# EAGLE design MUS-1099 (EAGLE 8.2.1)
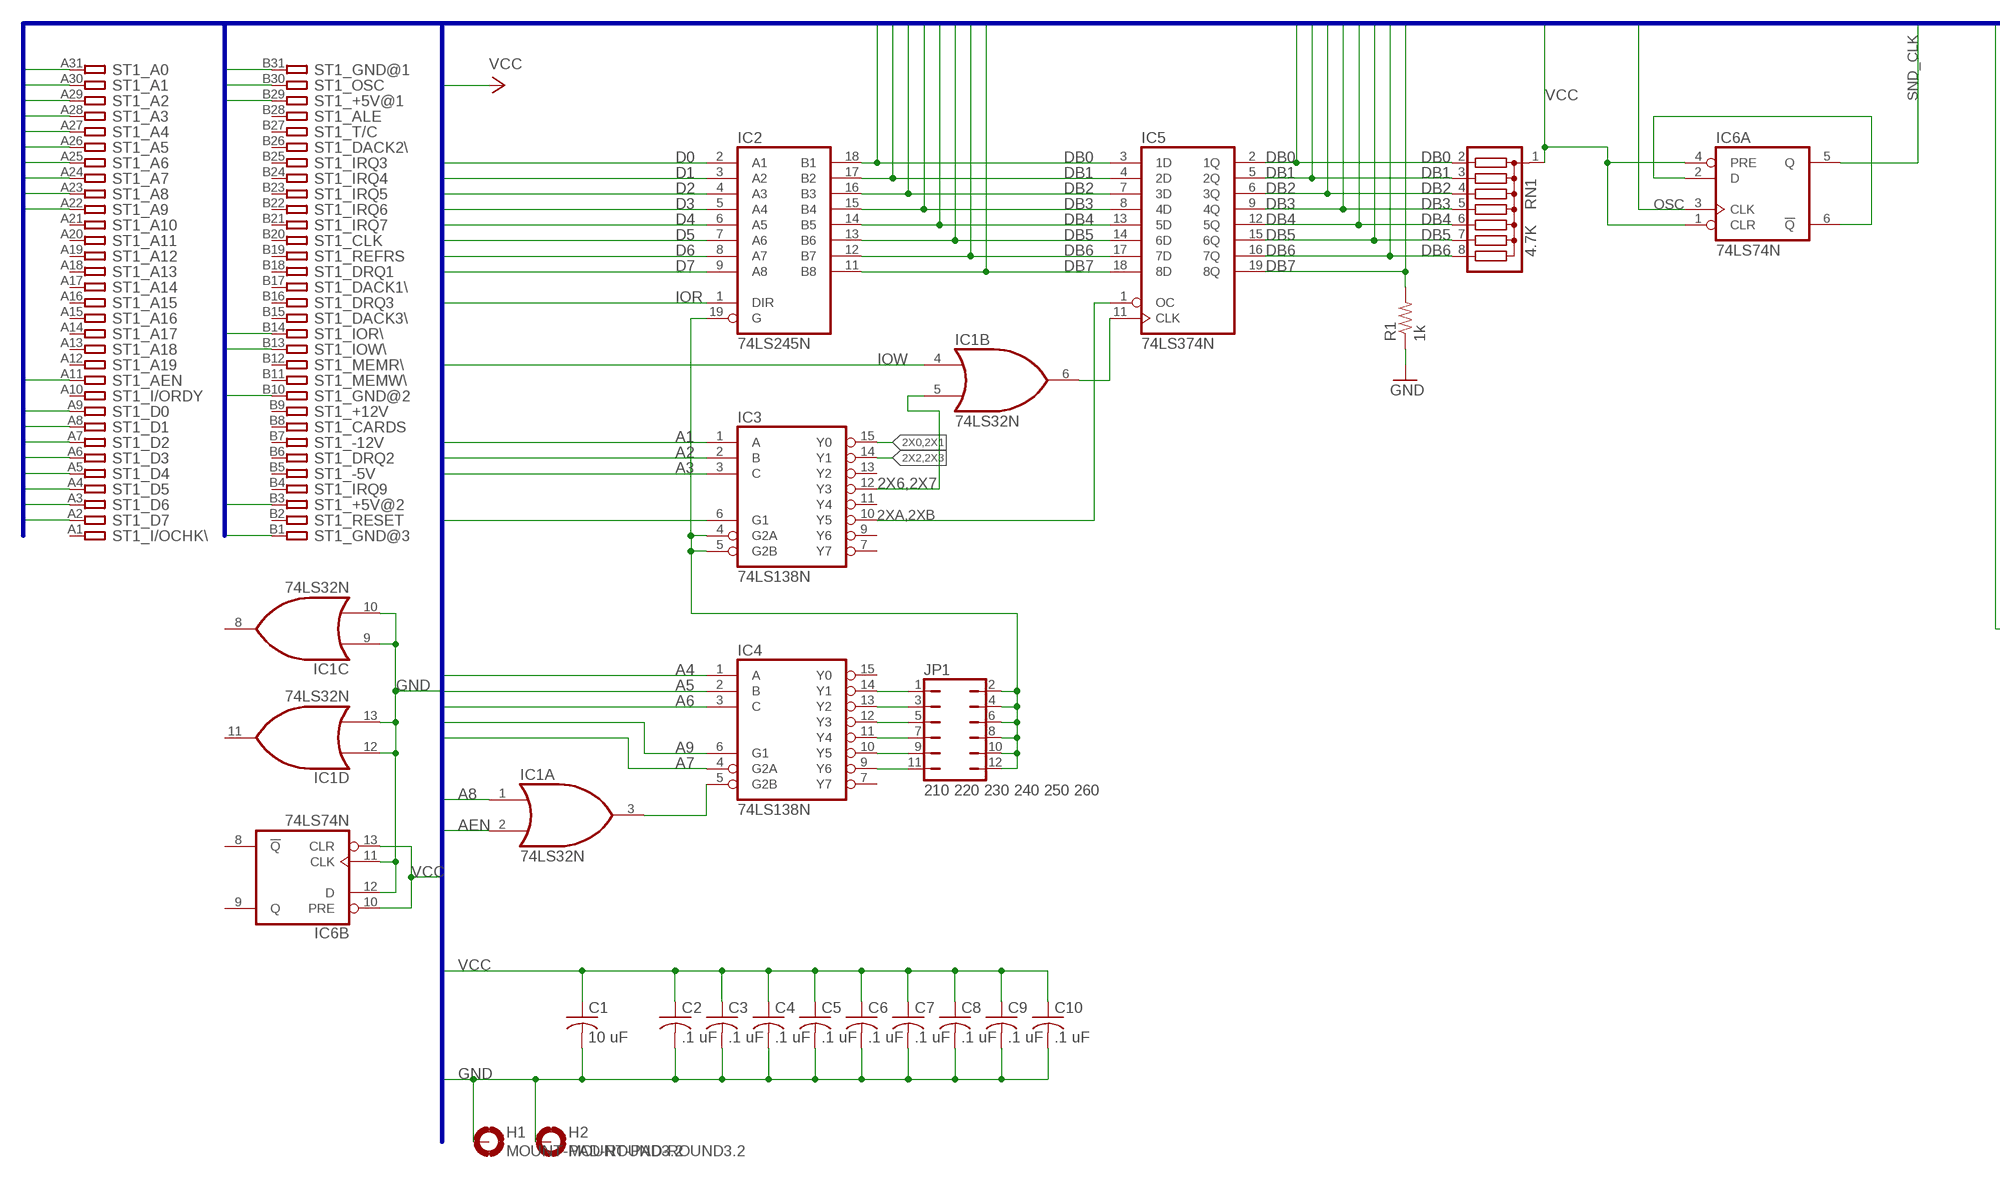
[diagram p0: schematic, sheet 1, part 1 of 2]
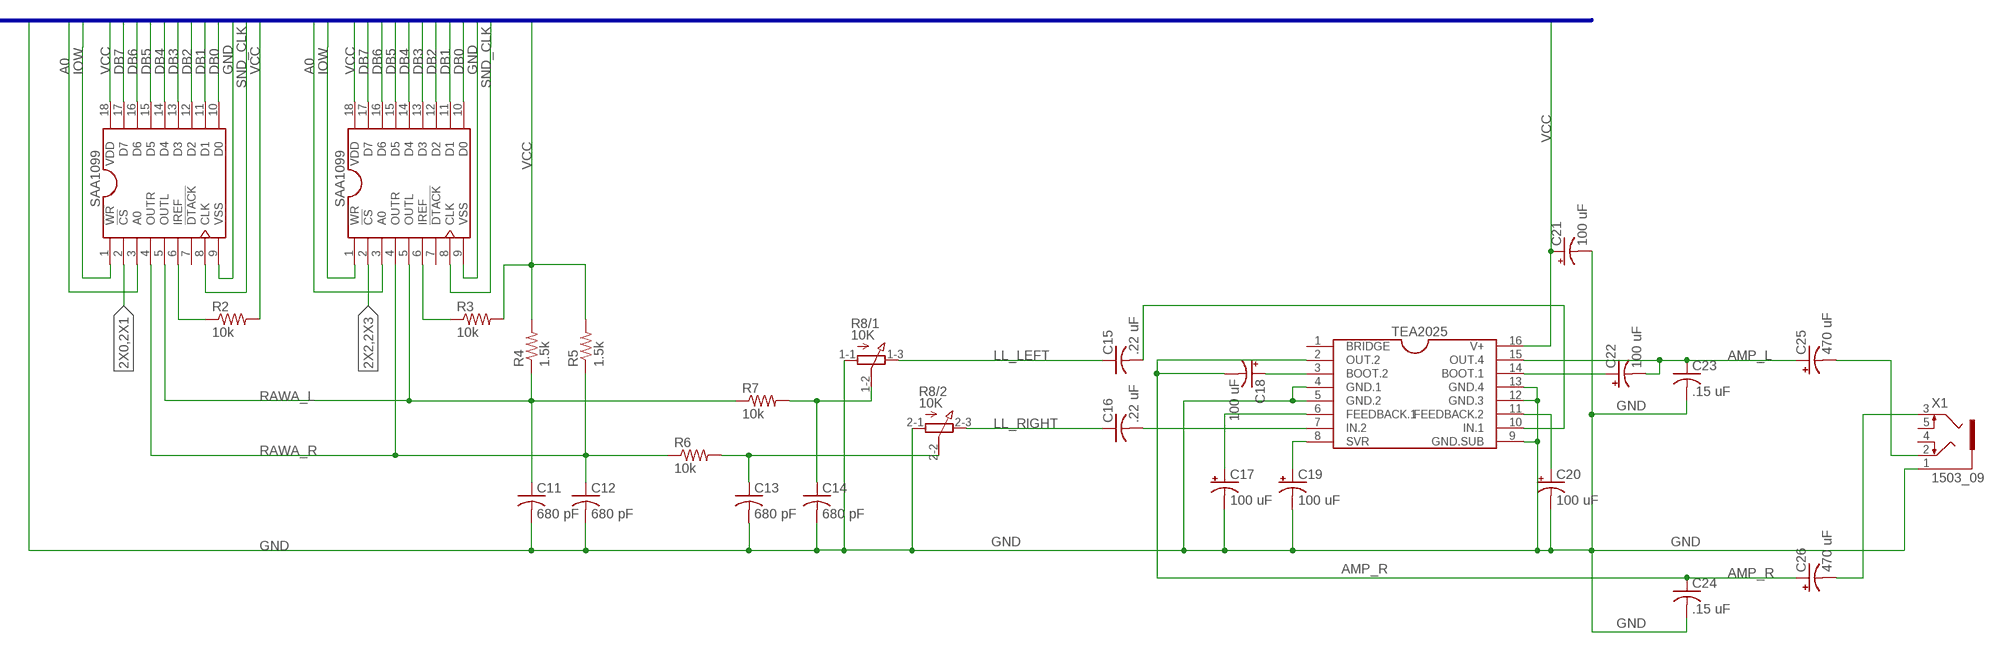
[diagram p1: schematic, sheet 1, part 2 of 2]

## Parts
C1  10 uF  C-US025-025X050  [C025-025X050]
C2  .1 uF  C-US025-025X050  [C025-025X050]
C3  .1 uF  C-US025-025X050  [C025-025X050]
C4  .1 uF  C-US025-025X050  [C025-025X050]
C5  .1 uF  C-US025-025X050  [C025-025X050]
C6  .1 uF  C-US025-025X050  [C025-025X050]
C7  .1 uF  C-US025-025X050  [C025-025X050]
C8  .1 uF  C-US025-025X050  [C025-025X050]
C9  .1 uF  C-US025-025X050  [C025-025X050]
C10  .1 uF  C-US025-025X050  [C025-025X050]
C11  680 pF  C-US025-025X050  [C025-025X050]
C12  680 pF  C-US025-025X050  [C025-025X050]
C13  680 pF  C-US025-025X050  [C025-025X050]
C14  680 pF  C-US025-025X050  [C025-025X050]
C15  .22 uF  C-US025-025X050  [C025-025X050]
C16  .22 uF  C-US025-025X050  [C025-025X050]
C17  100 uF  CPOL-USE5-10.5  [E5-10,5]
C18  100 uF  CPOL-USE5-10.5  [E5-10,5]
C19  100 uF  CPOL-USE5-10.5  [E5-10,5]
C20  100 uF  CPOL-USE5-10.5  [E5-10,5]
C21  100 uF  CPOL-USE5-10.5  [E5-10,5]
C22  100 uF  CPOL-USE5-10.5  [E5-10,5]
C23  .15 uF  C-US025-025X050  [C025-025X050]
C24  .15 uF  C-US025-025X050  [C025-025X050]
C25  470 uF  CPOL-USE5-10.5  [E5-10,5]
C26  470 uF  CPOL-USE5-10.5  [E5-10,5]
H1  MOUNT-PAD-ROUND3.2  [3,2-PAD]
H2  MOUNT-PAD-ROUND3.2  [3,2-PAD]
IC1  74LS32N  [DIL14]
IC2  74LS245N  [DIL20]
IC3  74LS138N  [DIL16]
IC4  74LS138N  [DIL16]
IC5  74LS374N  [DIL20]
IC6  74LS74N  [DIL14]
IC7  SAA1099  [DIL18]
IC8  SAA1099  [DIL18]
IC9  TEA2025  [DIL16]
JP1  210 220 230 240 250 260  JP6Q  [JP6Q]
R1  1k  R-US_0207/10  [0207/10]
R2  10k  R-US_0207/10  [0207/10]
R3  10k  R-US_0207/10  [0207/10]
R4  1.5k  R-US_0207/10  [0207/10]
R5  1.5k  R-US_0207/10  [0207/10]
R6  10k  R-US_0207/10  [0207/10]
R7  10k  R-US_0207/10  [0207/10]
R8  10K  3RP/1610G  [3RP/1610G]
RN1  4.7K  G07R  [SIL8]
ST1  8 bit ISA  IBM8BIT  [IBM8BIT]
X1  1503_09  [1503_09]

## Nets
2X0,2X1: IC3.15(Y0) IC7.2(!CS!)
2X2,2X3: IC3.14(Y1) IC8.2(!CS!)
2X6,2X7: IC1.5(B:I1) IC3.12(Y3)
2XA,2XB: IC3.10(Y5) IC5.1(OC)
A0: IC7.3(A0) IC8.3(A0) ST1.A31
A1: IC3.1(A) ST1.A30
A2: IC3.2(B) ST1.A29
A3: IC3.3(C) ST1.A28
A4: IC4.1(A) ST1.A27
A5: IC4.2(B) ST1.A26
A6: IC4.3(C) ST1.A25
A7: IC4.4(G2A) ST1.A24
A8: IC1.1(A:I0) ST1.A23
A9: IC4.6(G1) ST1.A22
AEN: IC1.2(A:I1) ST1.A11
AMP_L: C22.- C23.1 C25.+ IC9.15(OUT.4)
AMP_R: C18.- C24.1 C26.+ IC9.2(OUT.2)
D0: IC2.2(A1) ST1.A9
D1: IC2.3(A2) ST1.A8
D2: IC2.4(A3) ST1.A7
D3: IC2.5(A4) ST1.A6
D4: IC2.6(A5) ST1.A5
D5: IC2.7(A6) ST1.A4
D6: IC2.8(A7) ST1.A3
D7: IC2.9(A8) ST1.A2
DB0: IC2.18(B1) IC5.2(1Q) IC5.3(1D) IC7.10(D0) IC8.10(D0) RN1.2
DB1: IC2.17(B2) IC5.4(2D) IC5.5(2Q) IC7.11(D1) IC8.11(D1) RN1.3
DB2: IC2.16(B3) IC5.6(3Q) IC5.7(3D) IC7.12(D2) IC8.12(D2) RN1.4
DB3: IC2.15(B4) IC5.8(4D) IC5.9(4Q) IC7.13(D3) IC8.13(D3) RN1.5
DB4: IC2.14(B5) IC5.12(5Q) IC5.13(5D) IC7.14(D4) IC8.14(D4) RN1.6
DB5: IC2.13(B6) IC5.14(6D) IC5.15(6Q) IC7.15(D5) IC8.15(D5) RN1.7
DB6: IC2.12(B7) IC5.16(7Q) IC5.17(7D) IC7.16(D6) IC8.16(D6) RN1.8
DB7: IC2.11(B8) IC5.18(8D) IC5.19(8Q) IC7.17(D7) IC8.17(D7) R1.2
GND: C1.2 C2.2 C3.2 C4.2 C5.2 C6.2 C7.2 C8.2 C9.2 C10.2 C11.2 C12.2 C13.2 C14.2 C17.- C19.- C20.- C21.- C23.2 C24.2 H1.B3,2(MOUNT) H2.B3,2(MOUNT) IC1.9(C:I0) IC1.10(C:I1) IC1.12(D:I0) IC1.13(D:I1) IC6.11(B:CLK) IC6.12(B:D) IC7.9(VSS) IC8.9(VSS) IC9.4(GND.1) IC9.5(GND.2) IC9.9(GND.SUB) IC9.12(GND.3) IC9.13(GND.4) R1.1 R8.1-1(/1:A) R8.2-1(/2:A) ST1.B1 ST1.B10 ST1.B31 X1.1
IOR: IC2.1(DIR) ST1.B14
IOW: IC1.4(B:I0) IC7.1(!WR!) IC8.1(!WR!) ST1.B13
LL_LEFT: C15.1 R8.1-3(/1:E)
LL_RIGHT: C16.1 R8.2-3(/2:E)
N210: IC4.14(Y1) JP1.1
N220: IC4.13(Y2) JP1.3
N230: IC4.12(Y3) JP1.5
N240: IC4.11(Y4) JP1.7
N250: IC4.10(Y5) JP1.9
N260: IC4.9(Y6) JP1.11
N$1: IC1.3(A:O) IC4.5(G2B)
N$8: IC2.19(G) IC3.4(G2A) IC3.5(G2B) JP1.2 JP1.4 JP1.6 JP1.8 JP1.10 JP1.12
N$10: IC1.6(B:O) IC5.11(CLK)
N$11: IC6.2(A:D) IC6.6(A:!Q)
N$12: C13.1 R6.2 R8.2-2(/2:S)
N$13: C14.1 R7.2 R8.1-2(/1:S)
N$14: IC7.6(IREF) R2.1
N$15: IC8.6(IREF) R3.1
N$16: C16.2 IC9.7(IN.2)
N$17: C15.2 IC9.10(IN.1)
N$18: C17.+ IC9.6(FEEDBACK.1)
N$19: C20.+ IC9.11(FEEDBACK.2)
N$20: C25.- X1.2
N$21: C26.- X1.3
N$22: C19.+ IC9.8(SVR)
N$23: C22.+ IC9.14(BOOT.1)
N$25: C18.+ IC9.3(BOOT.2)
OSC: IC6.3(A:CLK) ST1.B30
RAWA_L: C11.1 IC7.5(OUTL) IC8.5(OUTL) R4.1 R7.1
RAWA_R: C12.1 IC7.4(OUTR) IC8.4(OUTR) R5.1 R6.1
SND_CLK: IC6.5(A:Q) IC7.8(CLK) IC8.8(CLK)
VCC: C1.1 C2.1 C3.1 C4.1 C5.1 C6.1 C7.1 C8.1 C9.1 C10.1 C21.+ IC3.6(G1) IC6.1(A:CLR) IC6.4(A:PRE) IC6.10(B:PRE) IC6.13(B:CLR) IC7.18(VDD) IC8.18(VDD) IC9.16(V+) R2.2 R3.2 R4.2 R5.2 RN1.1 ST1.B3 ST1.B29
Unconnected: IC1.8(C:O) IC1.11(D:O) IC3.7(Y7) IC3.9(Y6) IC3.11(Y4) IC3.13(Y2) IC4.7(Y7) IC4.15(Y0) IC6.8(B:!Q) IC6.9(B:Q) IC7.7(!DTACK!) IC8.7(!DTACK!) IC9.1(BRIDGE) ST1.A1 ST1.A10 ST1.A12 ST1.A13 ST1.A14 ST1.A15 ST1.A16 ST1.A17 ST1.A18 ST1.A19 ST1.A20 ST1.A21 ST1.B2 ST1.B4 ST1.B5 ST1.B6 ST1.B7 ST1.B8 ST1.B9 ST1.B11 ST1.B12 ST1.B15 ST1.B16 ST1.B17 ST1.B18 ST1.B19 ST1.B20 ST1.B21 ST1.B22 ST1.B23 ST1.B24 ST1.B25 ST1.B26 ST1.B27 ST1.B28 X1.4 X1.5

## Buses
A[0..9],AEN,IOR,D[0..7],DB[0..7],IOW,OSC,SND_CLK,VCC,GND

## Power pins joined to a net without a drawn wire
GND: IC1.7(P:GND) IC2.10(GND) IC3.8(GND) IC4.8(GND) IC5.10(GND) IC6.7(P:GND)
VCC: IC1.14(P:VCC) IC2.20(VCC) IC3.16(VCC) IC4.16(VCC) IC5.20(VCC) IC6.14(P:VCC)

## Library data of the parts
C1-C16 C23 C24 = resistor:C-US: CAPACITOR, American symbol
C17-C22 C25 C26 = rcl:CPOL-US: POLARIZED CAPACITOR, American symbol
H1 H2 = holes:MOUNT-PAD-ROUND: MOUNTING PAD, round
IC1 = 74xx-us:74*32: Quad 2-input OR gate
IC2 = 74xx-us:74*245: Octal BUS TRANSCEIVER, 3-state
IC3 IC4 = 74xx-us:74*138: 3-line to 8-line DECODER/DEMULTIPLEXER
IC5 = 74xx-us:74*374: Octal D type transparent LATCH, edge triggered
IC6 = 74xx-us:74*74: Dual D type positive edge triggered FLIP FLOP, preset and clear
IC7 IC8 = William-Custom:SAA1099
IC9 = William-Custom:TEA2025
JP1 = William-Custom:JP6Q: JUMPER
R1-R7 = resistor:R-US_: RESISTOR, American symbol
R8 = pot:3RP/1610G: 16mm Potentiometer two level Source: http://www.alphapotentiometers.net/html/16mm_pot_2.html
RN1 = resistor-sil:G07R: SIL RESISTOR; OC_FARNELL: unknown; OC_NEWARK: unknown
ST1 = William-Custom:IBM8BIT: 8-bit CARD IBM/PC-AT
X1 = con-lumberg:1503_09: Jack connectors according to JISC 6560, 3.5 mm Klinkeneinbaukupplung nach JISC 6560, 3,5 mm, 3-polig/ stereo, abgewinkelte Ausführung, mit 2 Öffnern und Lötaugen, für Leiterplatten Rückseitenmontage Source: http://www.lumberg.com/Produkte/PDFs/1503_09.pdf; OC_FARNELL: 1243244; OC_NEWARK: unknown

## Board
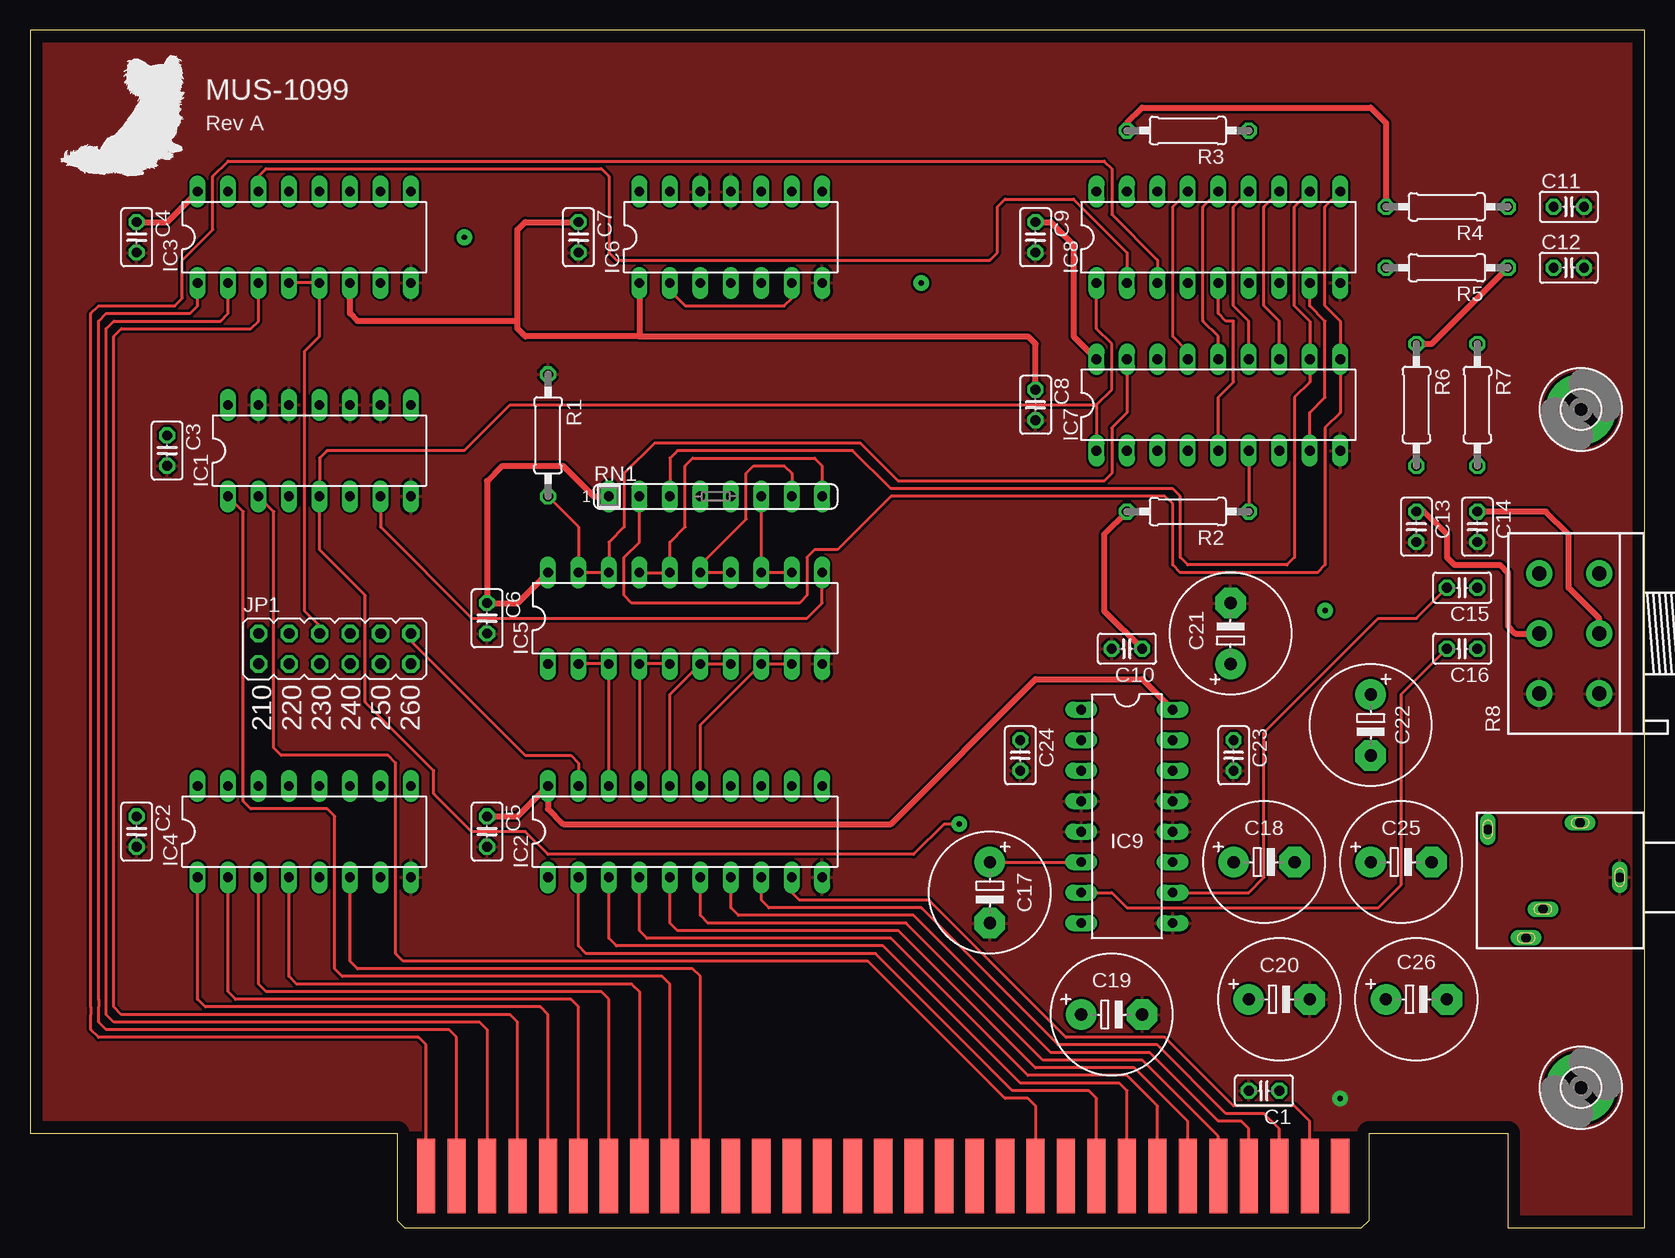
[diagram p2: board, top side]
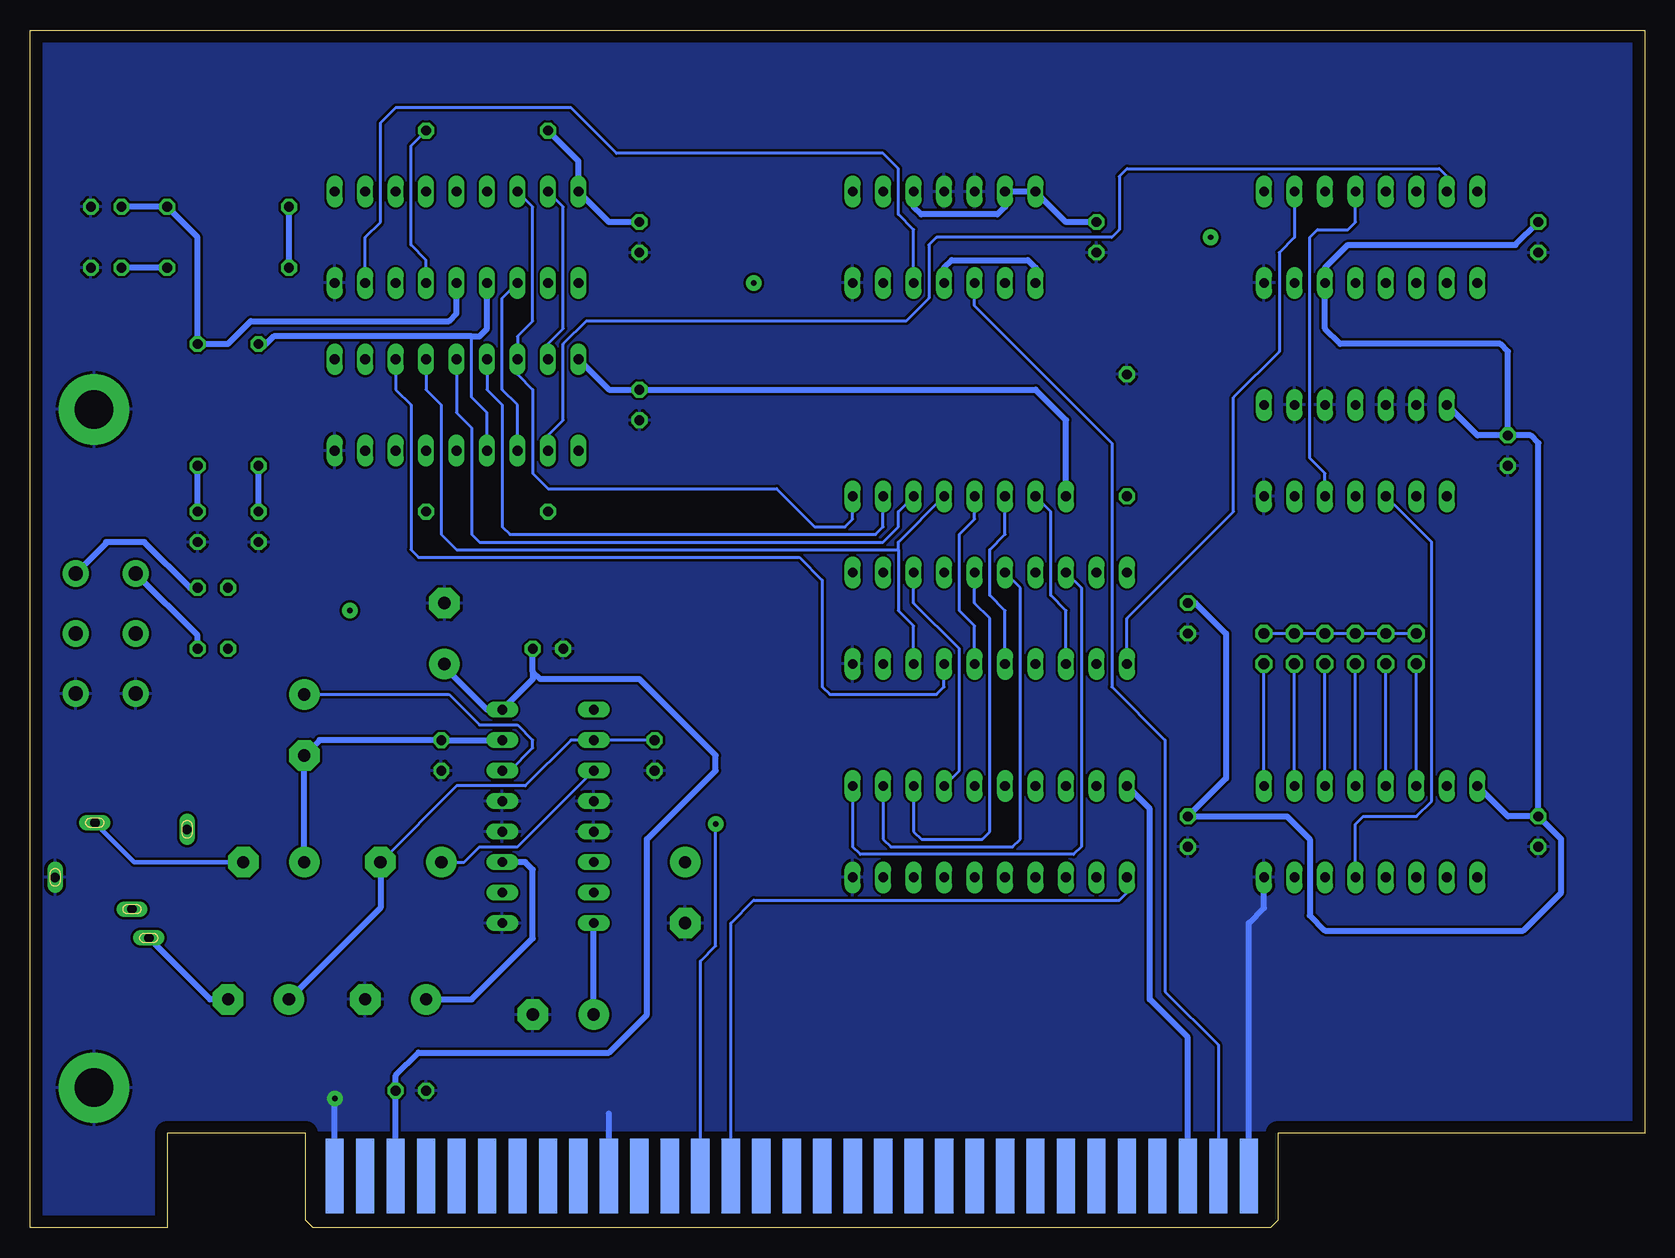
[diagram p3: board, bottom side, seen from below]

Size 134.62 x 99.82 mm. Coordinates in mm from the lower left corner, seen from the top.
Outline: 0,7.87 30.61,7.87 30.61,0.64 31.24,0 111,0 111.63,0.64 111.63,7.87 123.19,7.87 123.19,0 134.62,0 134.62,99.82 0,99.82 0,7.87
Copper layers (1*16): Top 0.035mm / dielectric 1.5mm / Bottom 0.035mm
Design rules "default *": minimum track width 8mil, minimum drill 16mil, track to track 8mil, track to pad 8mil, pad to pad 8mil, via to via 8mil, smd to smd 8mil, copper to edge 40mil, drill to drill 8mil, minimum pad ring 10mil, minimum via ring 8mil, stop-mask expansion 4mil, vias tented up to drill 0mil, thermal gap 10mil

### Footprints (pad centres in the part's own frame; a part is rotated, then mirrored left to right if it is on the bottom)
C025-025X050 = drill 0.813 octagon: 1 -1.27,0; 2 1.27,0
E5-10,5 = drill 1.016 pad 2.54: + -2.54,0 | drill 1.016 pad 2.54 octagon: - 2.54,0
3,2-PAD = drill 3.2 pad 5.842: B3,2 0,0
DIL14 = drill 0.813 long: 1 -7.62,-3.81; 2 -5.08,-3.81; 3 -2.54,-3.81; 4 0,-3.81; 5 2.54,-3.81; 6 5.08,-3.81; 7 7.62,-3.81; 8 7.62,3.81; 9 5.08,3.81; 10 2.54,3.81; 11 0,3.81; 12 -2.54,3.81; 13 -5.08,3.81; 14 -7.62,3.81
DIL20 = drill 0.813 long: 1 -11.43,-3.81; 2 -8.89,-3.81; 3 -6.35,-3.81; 4 -3.81,-3.81; 5 -1.27,-3.81; 6 1.27,-3.81; 7 3.81,-3.81; 8 6.35,-3.81; 9 8.89,-3.81; 10 11.43,-3.81; 11 11.43,3.81; 12 8.89,3.81; 13 6.35,3.81; 14 3.81,3.81; 15 1.27,3.81; 16 -1.27,3.81; 17 -3.81,3.81; 18 -6.35,3.81; 19 -8.89,3.81; 20 -11.43,3.81
DIL16 = drill 0.813 long: 1 -8.89,-3.81; 2 -6.35,-3.81; 3 -3.81,-3.81; 4 -1.27,-3.81; 5 1.27,-3.81; 6 3.81,-3.81; 7 6.35,-3.81; 8 8.89,-3.81; 9 8.89,3.81; 10 6.35,3.81; 11 3.81,3.81; 12 1.27,3.81; 13 -1.27,3.81; 14 -3.81,3.81; 15 -6.35,3.81; 16 -8.89,3.81
DIL18 = drill 0.813 long: 1 -10.16,-3.81; 2 -7.62,-3.81; 3 -5.08,-3.81; 4 -2.54,-3.81; 5 0,-3.81; 6 2.54,-3.81; 7 5.08,-3.81; 8 7.62,-3.81; 9 10.16,-3.81; 10 10.16,3.81; 11 7.62,3.81; 12 5.08,3.81; 13 2.54,3.81; 14 0,3.81; 15 -2.54,3.81; 16 -5.08,3.81; 17 -7.62,3.81; 18 -10.16,3.81
JP6Q = drill 0.914 octagon: 1 -6.35,-1.27; 2 -6.35,1.27; 3 -3.81,-1.27; 4 -3.81,1.27; 5 -1.27,-1.27; 6 -1.27,1.27; 7 1.27,-1.27; 8 1.27,1.27; 9 3.81,-1.27; 10 3.81,1.27; 11 6.35,-1.27; 12 6.35,1.27
0207/10 = drill 0.813 octagon: 1 -5.08,0; 2 5.08,0
3RP/1610G = drill 1.2 pad 2.184: 1-1 -5,0; 1-2 0,0; 1-3 5,0; 2-1 -5,5; 2-2 0,5; 2-3 5,5
SIL8 = drill 0.813 long: 1 -8.89,0; 2 -6.35,0; 3 -3.81,0; 4 -1.27,0; 5 1.27,0; 6 3.81,0; 7 6.35,0; 8 8.89,0
IBM8BIT = smd 1.524 x 6.223: A1 -25.4,4.826; A2 -27.94,4.826; A3 -30.48,4.826; A4 -33.02,4.826; A5 -35.56,4.826; A6 -38.1,4.826; A7 -40.64,4.826; A8 -43.18,4.826; A9 -45.72,4.826; A10 -48.26,4.826; A11 -50.8,4.826; A12 -53.34,4.826; A13 -55.88,4.826; A14 -58.42,4.826; A15 -60.96,4.826; A16 -63.5,4.826; A17 -66.04,4.826; A18 -68.58,4.826; A19 -71.12,4.826; A20 -73.66,4.826; A21 -76.2,4.826; A22 -78.74,4.826; A23 -81.28,4.826; A24 -83.82,4.826; A25 -86.36,4.826; A26 -88.9,4.826; A27 -91.44,4.826; A28 -93.98,4.826; A29 -96.52,4.826; A30 -99.06,4.826; A31 -101.6,4.826 | smd 1.524 x 6.223 bottom: B1 -25.4,4.826; B2 -27.94,4.826; B3 -30.48,4.826; B4 -33.02,4.826; B5 -35.56,4.826; B6 -38.1,4.826; B7 -40.64,4.826; B8 -43.18,4.826; B9 -45.72,4.826; B10 -48.26,4.826; B11 -50.8,4.826; B12 -53.34,4.826; B13 -55.88,4.826; B14 -58.42,4.826; B15 -60.96,4.826; B16 -63.5,4.826; B17 -66.04,4.826; B18 -68.58,4.826; B19 -71.12,4.826; B20 -73.66,4.826; B21 -76.2,4.826; B22 -78.74,4.826; B23 -81.28,4.826; B24 -83.82,4.826; B25 -86.36,4.826; B26 -88.9,4.826; B27 -91.44,4.826; B28 -93.98,4.826; B29 -96.52,4.826; B30 -99.06,4.826; B31 -101.6,4.826
1503_09 = drill 0.8 pad 1.2 long: 1 0,-2.1; 2 -4.55,-5.4; 3 5.05,-9.9; 4 -4,-13.1; 5 2.65,-8.5

### Placement (x,y rotation side)
C1  102.87,11.43 180 top
C2  8.89,33.02 270 top
C3  11.43,64.77 270 top
C4  8.89,82.55 270 top
C5  38.1,33.02 270 top
C6  38.1,50.8 270 top
C7  45.72,82.55 270 top
C8  83.82,68.58 270 top
C9  83.82,82.55 270 top
C10  91.44,48.26 180 top
C11  128.27,85.09 0 top
C12  128.27,80.01 0 top
C13  115.57,58.42 270 top
C14  120.65,58.42 270 top
C15  119.38,53.34 180 top
C16  119.38,48.26 180 top
C17  80.01,27.94 270 top
C18  102.87,30.48 0 top
C19  90.17,17.78 0 top
C20  104.14,19.05 0 top
C21  100.08,49.53 90 top
C22  111.76,41.91 270 top
C23  100.33,39.37 270 top
C24  82.55,39.37 270 top
C25  114.3,30.48 0 top
C26  115.57,19.05 0 top
H1  129.29,68.2 0 top
H2  129.29,11.68 0 top
IC1  24.13,64.77 0 top
IC2  54.61,33.02 0 top
IC3  22.86,82.55 0 top
IC4  22.86,33.02 0 top
IC5  54.61,50.8 0 top
IC6  58.42,82.55 0 top
IC7  99.06,68.58 0 top
IC8  99.06,82.55 0 top
IC9  91.44,34.29 270 top
JP1  25.4,48.26 0 top
R1  43.18,66.04 270 top
R2  96.52,59.69 180 top
R3  96.52,91.44 180 top
R4  118.11,85.09 180 top
R5  118.11,80.01 180 top
R6  115.57,68.58 270 top
R7  120.65,68.58 270 top
R8  130.81,49.53 90 top
RN1  57.15,60.96 0 top
ST1  134.62,-0.51 0 top
U$1  [LOGO]  2.54,87.63 0 top
X1  134.62,29.21 270 top

### Tracks (layer width: path | path; a pad name or v marks a point on that pad's centre or on a via)
2X0,2X1
  Bottom 0.254: IC7.2 91.44,66.04 90.17,67.31 90.17,73.66 88.27,75.56 61.59,75.56 59.69,77.47 59.69,81.92 59.05,82.55 44.45,82.55 43.81,83.19 43.81,87.63 43.18,88.27 17.14,88.27 16.51,87.63 IC3.15
2X2,2X3
  Top 0.254: IC3.14 19.05,87.63 19.68,88.27 47.62,88.27 48.26,87.63 48.26,81.28 48.9,80.64 80.01,80.64 80.64,81.28 80.64,85.09 81.28,85.72 87,85.72 91.44,81.28 91.44,80.01 91.44,79.38 IC8.2
2X6,2X7
  Bottom 0.254: IC1.5 26.67,62.87 27.94,64.14 27.94,82.55 27.3,83.19 24.77,83.19 24.13,83.82 IC3.12
2XA,2XB
  Bottom 0.254: IC3.10 29.21,82.55 30.48,81.28 30.48,73.03 34.29,69.22 34.29,59.69 43.18,50.8 IC5.1
A0
  Top 0.254: IC8.3 93.98,80.64 90.17,84.45 90.17,88.27 89.53,88.9 16.51,88.9 15.24,87.63 15.24,83.19 12.7,80.64 12.7,77.47 12.06,76.83 5.71,76.83 5.08,76.2 5.08,18.41 5.08,17.78 5.08,16.51 5.71,15.88 32.38,15.88 33.02,15.24 ST1.A31
  Bottom 0.254: IC8.3 95.25,77.47 95.25,69.85 93.98,68.58 IC7.3
A1
  Top 0.254: IC3.1 13.97,76.83 13.34,76.2 6.35,76.2 5.71,75.56 5.71,19.05 5.71,18.41 5.71,17.14 6.35,16.51 34.92,16.51 35.56,15.88 ST1.A30
A2
  Top 0.254: IC3.2 16.51,76.2 15.88,75.56 6.99,75.56 6.35,74.93 6.35,17.78 6.99,17.14 37.47,17.14 38.1,16.51 ST1.A29 38.1,3.81
A3
  Top 0.254: IC3.3 19.05,75.56 18.41,74.93 7.62,74.93 6.99,74.3 6.99,18.41 7.62,17.78 40.01,17.78 40.64,17.14 ST1.A28
A4
  Top 0.254: ST1.A27 43.18,17.78 42.55,18.41 14.61,18.41 13.97,19.05 IC4.1
A5
  Top 0.254: ST1.A26 45.72,18.41 45.09,19.05 17.14,19.05 16.51,19.68 IC4.2
A6
  Top 0.254: ST1.A25 48.26,19.05 47.62,19.68 19.68,19.68 19.05,20.32 IC4.3
A7
  Top 0.254: ST1.A24 50.8,19.68 50.16,20.32 22.23,20.32 21.59,20.95 IC4.4
A8
  Top 0.254: ST1.A23 53.34,20.32 52.7,20.95 26.04,20.95 25.4,21.59 25.4,34.29 24.77,34.92 18.41,34.92 17.78,35.56 17.78,59.69 IC1.1
A9
  Top 0.254: ST1.A22 55.88,20.95 55.24,21.59 27.3,21.59 26.67,22.23 IC4.6
AEN
  Top 0.254: IC1.2 20.32,59.69 20.32,40.01 20.95,39.37 29.84,39.37 30.48,38.73 30.48,22.86 31.11,22.23 69.85,22.23 81.28,10.79 83.19,10.79 83.82,10.16 ST1.A11
AMP_L
  Bottom 0.508: C25.+ C22.- 110.49,40.64 C23.1 IC9.15
AMP_R
  Bottom 0.254: C18.- 99.06,36.83 93.34,36.83 89.53,40.64 IC9.2 C24.1
  Bottom 0.508: C18.- 105.41,26.67 C26.+
D0
  Top 0.254: ST1.A9 88.9,10.79 88.27,11.43 81.92,11.43 70.48,22.86 46.35,22.86 45.72,23.5 IC2.2
D1
  Top 0.254: ST1.A8 91.44,11.43 90.81,12.06 82.55,12.06 71.12,23.5 48.9,23.5 48.26,24.13 IC2.3
D2
  Top 0.254: ST1.A7 93.98,10.16 91.44,12.7 83.19,12.7 71.75,24.13 51.44,24.13 50.8,24.77 IC2.4
D3
  Top 0.254: ST1.A6 96.52,8.89 92.08,13.34 83.82,13.34 72.39,24.77 53.98,24.77 53.34,25.4 IC2.5
D4
  Top 0.254: IC2.6 55.88,26.04 56.52,25.4 73.03,25.4 84.45,13.97 92.71,13.97 99.06,7.62 ST1.A5
D5
  Top 0.254: IC2.7 58.42,26.67 59.05,26.04 73.66,26.04 85.09,14.61 93.34,14.61 99.06,8.89 100.97,8.89 101.6,8.26 ST1.A4
D6
  Top 0.254: IC2.8 60.96,27.3 61.59,26.67 74.3,26.67 85.72,15.24 93.98,15.24 99.69,9.53 102.87,9.53 104.14,8.26 ST1.A3
D7
  Top 0.254: ST1.A2 106.68,8.89 105.41,10.16 100.33,10.16 94.61,15.88 86.36,15.88 74.93,27.3 64.14,27.3 63.5,27.94 IC2.9
DB0
  Top 0.254: IC8.10 107.95,85.09 107.95,76.83 109.22,75.56 IC7.10 109.22,67.94 107.95,66.67 107.95,55.24 107.31,54.61 95.89,54.61 95.25,55.24 95.25,60.33 94.61,60.96 71.75,60.96 67.31,56.52 65.41,56.52 64.77,55.88 64.77,52.7 64.14,52.07 50.16,52.07 49.53,52.7 49.53,55.88 50.8,57.15 RN1.2 | IC2.18 IC5.3 IC5.2
  Bottom 0.254: IC5.3 48.26,51.44 49.53,52.7 49.53,59.69 RN1.2
DB1
  Top 0.254: IC8.11 105.41,85.09 105.41,76.83 106.68,75.56 IC7.11 106.68,70.48 105.41,69.22 105.41,55.88 104.78,55.24 96.52,55.24 95.89,55.88 95.89,60.96 95.25,61.59 71.75,61.59 68.58,64.77 53.98,64.77 53.34,64.14 RN1.3 | IC5.5 IC5.4 IC2.17
  Bottom 0.254: IC5.5 53.34,51.44 54.61,52.7 54.61,56.52 53.34,57.78 RN1.3
DB2
  Top 0.254: IC7.12 104.14,75.56 102.87,76.83 102.87,85.09 IC8.12 | IC2.16 53.34,44.45 IC5.6 IC5.7
  Bottom 0.254: IC5.6 55.88,50.16 57.15,51.44 57.15,57.78 55.88,59.05 RN1.4 | IC7.12 104.14,69.85 102.87,68.58 102.87,56.52 102.23,55.88 70.48,55.88 68.58,53.98 68.58,45.09 67.94,44.45 59.05,44.45 58.42,45.09 IC5.7
DB3
  Top 0.254: IC7.13 101.6,75.56 100.33,76.83 100.33,85.09 IC8.13 | IC5.9 IC5.8 55.88,41.91 IC2.15
  Bottom 0.254: IC5.8 60.96,50.16 62.23,51.44 62.23,56.52 | 62.23,56.52 62.23,57.15 RN1.5 | IC7.13 101.6,69.85 100.33,68.58 100.33,57.78 99.06,56.52 62.23,56.52
DB4
  Top 0.254: IC7.14 99.06,74.3 97.79,75.56 97.79,85.09 IC8.14 | IC5.12 IC5.13 RN1.6
  Bottom 0.254: IC2.14 57.15,38.1 57.15,48.26 60.96,52.07 IC5.13 | IC7.14 99.06,67.94 97.79,66.67 97.79,57.78 97.16,57.15 63.5,57.15 62.23,58.42 62.23,59.69 RN1.6
DB5
  Top 0.254: IC7.15 96.52,73.03 95.25,74.3 95.25,85.09 IC8.15 | IC5.14 IC5.15 55.88,55.24 59.69,59.05 59.69,62.87 60.33,63.5 62.87,63.5 63.5,62.87 RN1.7
  Bottom 0.254: IC2.13 60.96,33.02 60.33,32.38 55.24,32.38 54.61,33.02 54.61,50.8 55.88,52.07 IC5.15 | IC7.15 96.52,69.85 95.25,68.58 95.25,58.42 94.61,57.78 64.14,57.78 63.5,58.42 RN1.7
DB6
  Top 0.254: IC5.17 IC5.16 53.34,57.15 54.61,58.42 54.61,63.5 55.24,64.14 65.41,64.14 66.04,63.5 RN1.8
  Bottom 0.254: IC8.16 92.71,85.09 92.71,75.56 93.98,74.3 IC7.16 93.98,71.12 92.71,69.85 92.71,62.87 91.44,61.59 72.39,61.59 69.22,58.42 66.67,58.42 66.04,59.05 RN1.8 | IC2.12 63.5,32.38 62.87,31.75 52.7,31.75 52.07,32.38 52.07,53.34 IC5.16
DB7
  Top 0.254: R1.2 45.72,58.42 IC5.19 IC5.18 48.26,57.15 49.53,58.42 49.53,62.87 52.07,65.41 69.22,65.41 72.39,62.23 89.53,62.23 90.17,62.87 90.17,66.67 91.44,67.94 IC7.17
  Bottom 0.254: IC7.17 91.44,73.66 90.17,74.93 90.17,85.09 IC8.17 | IC5.18 46.99,53.34 46.99,31.75 47.62,31.11 65.41,31.11 66.04,31.75 IC2.11
GND  (via drill 0.45 pad 1.3)
  Bottom 0.508: ST1.B1 v109.22,10.79 | ST1.B31 33.02,25.4 31.75,26.67 IC4.8 | ST1.B10 86.36,9.53
  pour Top: -1.27,100.08 135.13,100.33 135.13,8.13 -1.27,8.13
  pour Top: 122.56,-0.64 135.25,-0.64 135.25,8.89 122.56,8.89
  pour Bottom: -2.54,100.33 135.89,100.33 135.89,8.13 -2.54,8.13
  pour Bottom: 121.92,8.89 121.92,-1.27 135.89,-1.27 135.89,8.89
IOR
  Bottom 0.254: ST1.B14 76.2,25.4 74.3,27.3 43.81,27.3 43.18,27.94 IC2.1
IOW  (via drill 0.45 pad 1.3)
  Top 0.254: 88.9,68.58 IC7.1 | 88.9,68.58 90.17,69.85 90.17,73.66 88.9,74.93 IC8.1 | IC1.4 24.13,61.59 | IC1.4 24.13,64.14 24.77,64.77 36.2,64.77 40.01,68.58 88.9,68.58 | IC1.4 24.13,56.52 27.94,52.7 27.94,43.81 33.66,38.1 33.66,36.2 36.83,33.02 41.27,33.02 43.18,31.11 73.66,31.11 76.2,33.66 v77.47,33.66
  Bottom 0.254: ST1.B13 78.74,22.23 77.47,23.5 v77.47,33.66
LL_LEFT
  Bottom 0.508: C15.1 121.28,53.34 125.09,57.15 128.27,57.15 128.27,57.07 R8.1-3
LL_RIGHT
  Bottom 0.508: C16.1 120.65,49.37 R8.2-3
N210
  Bottom 0.254: IC4.14 JP1.1
N220
  Bottom 0.254: IC4.13 JP1.3
N230
  Bottom 0.254: IC4.12 JP1.5
N240
  Bottom 0.254: IC4.11 JP1.7
N250
  Bottom 0.254: IC4.10 JP1.9
N260
  Bottom 0.254: IC4.9 JP1.11
N$1
  Bottom 0.254: IC4.5 24.13,33.66 23.5,34.29 19.05,34.29 17.78,35.56 17.78,57.15 IC1.3
N$2  (via drill 0.45 pad 1.3)
  other vias: 36.2,82.55
N$3  (via drill 0.45 pad 1.3)
  other vias: 74.3,78.74
N$4  (via drill 0.45 pad 1.3)
  other vias: 107.95,51.44
N$8
  Top 0.254: IC3.4 IC3.5 24.13,74.3 22.86,73.03 22.86,51.44 24.13,50.16 JP1.6 | JP1.12 31.75,48.9 41.27,39.37 45.09,39.37 45.72,38.73 IC2.19
  Bottom 0.254: JP1.2 JP1.4 JP1.6 JP1.8 JP1.10 JP1.12
N$10
  Top 0.254: IC1.6 29.21,58.42 36.83,50.8 64.77,50.8 66.04,52.07 IC5.11
N$11
  Top 0.254: IC6.2 53.34,78.11 54.61,76.83 62.87,76.83 63.5,77.47 IC6.6
N$12
  Top 0.508: C13.1 116.2,59.69 118.11,57.78 118.11,55.88 118.75,55.24 122.56,55.24 123.19,54.61 123.19,50.16 123.83,49.53 R8.2-2
  Bottom 0.508: C13.1 R6.2
N$13
  Top 0.508: R8.1-2 130.81,50.8 128.27,53.34 128.27,57.78 126.36,59.69 C14.1
  Bottom 0.508: C14.1 R7.2
N$14
  Top 0.254: IC7.6 R2.1
N$15
  Bottom 0.254: IC8.6 101.6,80.64 102.87,81.92 102.87,90.17 R3.1
N$16
  Top 0.254: IC9.7 90.17,27.94 91.44,26.67 112.39,26.67 114.3,28.57 114.3,44.45 C16.2
N$17
  Top 0.254: IC9.10 101.6,27.94 102.87,29.21 102.87,41.27 112.39,50.8 115.57,50.8 C15.2
N$18
  Top 0.254: C17.+ IC9.6
N$19
  Bottom 0.508: C20.+ 97.79,19.05 92.71,24.13 92.71,29.84 93.34,30.48 IC9.11
N$20
  Bottom 0.381: C25.- 125.94,30.48 X1.2
N$21
  Bottom 0.508: 119.38,19.05 C26.- 119.61,19.05 X1.3
N$22
  Bottom 0.508: C19.+ IC9.8
N$23
  Bottom 0.254: C22.+ 99.69,44.45 97.16,41.91 93.98,41.91 92.71,40.64 92.71,40.01 94.61,38.1 IC9.14
N$25
  Bottom 0.254: C18.+ 98.42,30.48 97.16,31.75 93.98,31.75 IC9.3
OSC
  Bottom 0.254: ST1.B30 35.56,15.24 40.01,19.68 40.01,40.64 44.45,45.09 44.45,65.41 55.88,76.83 IC6.3
RAWA_L
  Top 0.254: IC7.5 99.06,69.22 100.33,70.48 100.33,75.56 99.69,75.56 99.06,76.2 IC8.5
  Bottom 0.508: C11.1 R4.1 120.65,82.55 R7.1 118.11,73.66 116.2,75.56 99.69,75.56 99.06,76.2 IC8.5
RAWA_R
  Top 0.508: R6.1 116.84,73.66 R5.1
  Bottom 0.254: 97.79,74.3 97.79,69.22 96.52,67.94 IC7.4
  Bottom 0.508: R5.1 C12.1 | R6.1 114.94,73.66 114.3,74.3 97.79,74.3 97.16,74.3 96.52,74.93 IC8.4
SND_CLK
  Top 0.254: IC7.8 106.68,67.94 107.95,69.22 107.95,75.56 106.68,76.83 IC8.8
  Bottom 0.254: IC8.8 106.68,82.55 105.41,83.82 105.41,92.08 104.14,93.34 89.53,93.34 85.72,89.53 63.5,89.53 62.23,88.27 62.23,84.45 60.96,83.19 IC6.5
VCC
  Top 0.508: C9.1 85.09,83.82 87,81.92 87,74.3 IC7.18 | R3.2 91.44,92.08 92.71,93.34 111.76,93.34 113.03,92.08 R4.2 | C8.1 83.82,73.66 83.19,74.3 50.8,74.3 | 50.8,74.3 41.27,74.3 40.64,74.93 40.64,75.56 | 40.64,75.56 40.64,83.19 41.27,83.82 C7.1 | IC6.1 50.8,74.3 | RN1.1 46.99,60.96 44.45,63.5 39.37,63.5 38.1,62.23 C6.1 40.64,52.07 IC5.20 | 40.64,75.56 27.3,75.56 26.67,76.2 IC3.6 | C4.1 11.43,83.82 IC3.16 | C5.1 40.64,34.29 IC2.20 43.18,34.92 44.45,33.66 71.75,33.66 83.82,45.72 92.71,45.72 IC9.16 | R2.2 89.53,57.78 89.53,51.44 C10.1
  Bottom 0.508: 92.71,46.35 C10.1 | 92.71,46.35 92.71,45.72 IC9.16 96.52,43.18 100.08,46.74 C21.+ | C9.1 86.36,83.82 IC8.18 88.9,88.9 R3.2 | IC7.18 86.36,69.85 C8.1 50.8,69.85 48.26,67.31 RN1.1 | C2.1 11.43,34.29 IC4.16 | C3.1 13.97,66.04 IC1.14 | C7.1 48.26,83.82 IC6.14 IC6.13 53.34,85.09 53.98,84.45 60.33,84.45 60.96,85.09 IC6.10 | R5.2 R4.2 | IC6.4 58.42,80.01 57.78,80.64 51.44,80.64 50.8,80.01 IC6.1 | C4.1 10.79,81.92 24.77,81.92 26.67,80.01 IC3.6 26.67,74.93 25.4,73.66 12.06,73.66 11.43,73.03 C3.1 | C6.1 37.47,52.07 34.92,49.53 34.92,37.47 C5.1 29.84,34.29 27.94,32.38 27.94,26.04 26.67,24.77 10.16,24.77 6.99,27.94 6.99,32.38 C2.1 | C2.1 8.89,65.41 9.53,66.04 C3.1 | ST1.B29 38.1,15.88 41.27,19.05 41.27,34.92 IC2.20 | ST1.B3 C1.1 104.14,12.7 102.23,14.61 86.36,14.61 83.19,17.78 83.19,32.38 77.47,38.1 77.47,39.37 83.82,45.72 92.08,45.72 92.71,46.35

### Text on the board
tPlace: MUS-1099 | Rev A
tNames: 210 / 220 / 230 / 240 / 250 / 260